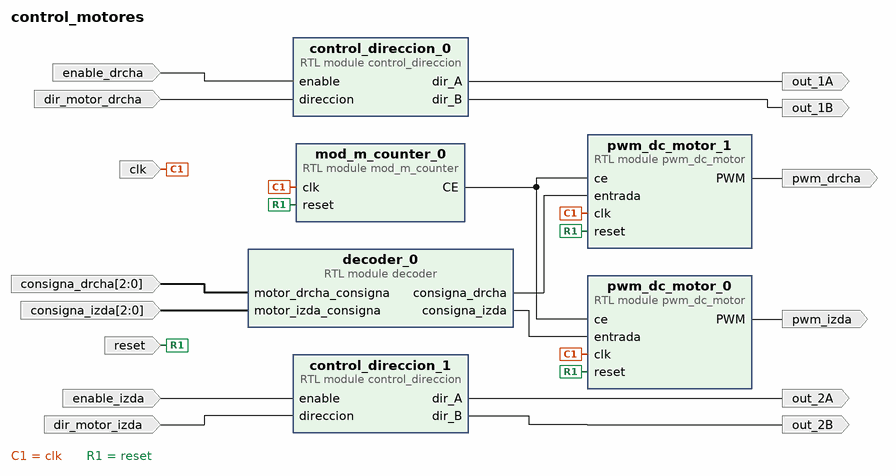
[diagram p0: block diagram of the top level]
# Vivado block design control_motores, xc7z020clg484-1, Vivado 2017.4
create_bd_design control_motores

create_bd_port -dir I clk
create_bd_port -dir I reset
create_bd_port -dir I enable_drcha
create_bd_port -dir I dir_motor_drcha
create_bd_port -dir O pwm_drcha
create_bd_port -dir O out_1A
create_bd_port -dir O out_1B
create_bd_port -dir O pwm_izda
create_bd_port -dir I enable_izda
create_bd_port -dir I dir_motor_izda
create_bd_port -dir I -from 2 -to 0 consigna_drcha
create_bd_port -dir I -from 2 -to 0 consigna_izda
create_bd_port -dir O out_2A
create_bd_port -dir O out_2B

create_bd_cell -type module -reference mod_m_counter mod_m_counter_0
create_bd_cell -type module -reference pwm_dc_motor pwm_dc_motor_0
create_bd_cell -type module -reference pwm_dc_motor pwm_dc_motor_1
create_bd_cell -type module -reference control_direccion control_direccion_0
create_bd_cell -type module -reference control_direccion control_direccion_1
create_bd_cell -type module -reference decoder decoder_0

# ---- connections ----

connect_bd_net [get_bd_ports clk] [get_bd_pins mod_m_counter_0/clk] [get_bd_pins pwm_dc_motor_1/clk] [get_bd_pins pwm_dc_motor_0/clk]
connect_bd_net [get_bd_ports reset] [get_bd_pins mod_m_counter_0/reset] [get_bd_pins pwm_dc_motor_1/reset] [get_bd_pins pwm_dc_motor_0/reset]
connect_bd_net [get_bd_pins mod_m_counter_0/CE] [get_bd_pins pwm_dc_motor_1/ce] [get_bd_pins pwm_dc_motor_0/ce]
connect_bd_net [get_bd_pins decoder_0/consigna_drcha] [get_bd_pins pwm_dc_motor_1/entrada]
connect_bd_net [get_bd_pins decoder_0/consigna_izda] [get_bd_pins pwm_dc_motor_0/entrada]
connect_bd_net [get_bd_ports enable_drcha] [get_bd_pins control_direccion_0/enable]
connect_bd_net [get_bd_ports dir_motor_drcha] [get_bd_pins control_direccion_0/direccion]
connect_bd_net [get_bd_pins pwm_dc_motor_1/PWM] [get_bd_ports pwm_drcha]
connect_bd_net [get_bd_pins control_direccion_0/dir_A] [get_bd_ports out_1A]
connect_bd_net [get_bd_pins control_direccion_0/dir_B] [get_bd_ports out_1B]
connect_bd_net [get_bd_pins pwm_dc_motor_0/PWM] [get_bd_ports pwm_izda]
connect_bd_net [get_bd_ports enable_izda] [get_bd_pins control_direccion_1/enable]
connect_bd_net [get_bd_ports dir_motor_izda] [get_bd_pins control_direccion_1/direccion]
connect_bd_net [get_bd_ports consigna_drcha] [get_bd_pins decoder_0/motor_drcha_consigna]
connect_bd_net [get_bd_ports consigna_izda] [get_bd_pins decoder_0/motor_izda_consigna]
connect_bd_net [get_bd_pins control_direccion_1/dir_A] [get_bd_ports out_2A]
connect_bd_net [get_bd_pins control_direccion_1/dir_B] [get_bd_ports out_2B]

validate_bd_design
save_bd_design
